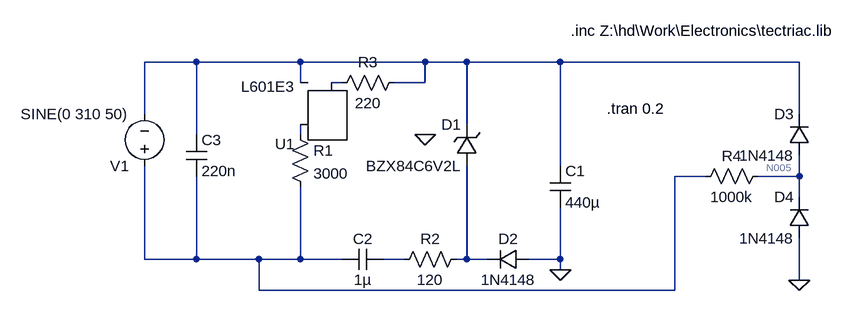
[diagram p0: schematic triac_experiments.asc]
triac_experiments.asc, the LTspice schematic file:
Version 4
SHEET 1 916 680
WIRE -128 32 -208 32
WIRE 32 32 -128 32
WIRE 224 32 32 32
WIRE 288 32 224 32
WIRE 432 32 288 32
WIRE 800 32 432 32
WIRE 32 64 32 32
WIRE 96 64 80 64
WIRE 224 64 224 32
WIRE 224 64 176 64
WIRE -208 112 -208 32
WIRE 800 112 800 32
WIRE 288 128 288 32
WIRE -128 144 -128 32
WIRE 32 144 32 128
WIRE 432 192 432 32
WIRE 656 208 608 208
WIRE 800 208 800 176
WIRE 800 208 736 208
WIRE 800 240 800 208
WIRE -208 336 -208 192
WIRE -128 336 -128 208
WIRE -128 336 -208 336
WIRE -32 336 -128 336
WIRE 32 336 32 224
WIRE 32 336 -32 336
WIRE 96 336 32 336
WIRE 192 336 160 336
WIRE 288 336 288 192
WIRE 288 336 272 336
WIRE 320 336 288 336
WIRE 432 336 432 256
WIRE 432 336 384 336
WIRE 432 352 432 336
WIRE 800 368 800 304
WIRE -32 384 -32 336
WIRE 608 384 608 208
WIRE 608 384 -32 384
FLAG 432 352 0
FLAG 224 144 0
FLAG 800 368 0
SYMBOL Misc\\TRIAC 64 128 R180
SYMATTR InstName U1
SYMATTR Value L601E3
SYMBOL voltage -208 208 R180
WINDOW 123 0 0 Left 2
WINDOW 39 0 0 Left 2
SYMATTR InstName V1
SYMATTR Value SINE(0 310 50)
SYMBOL res 16 128 R0
SYMATTR InstName R1
SYMATTR Value 3000
SYMBOL zener 304 192 R180
WINDOW 0 24 64 Left 2
WINDOW 3 24 0 Left 2
SYMATTR InstName D1
SYMATTR Value BZX84C6V2L
SYMBOL res 288 320 R90
WINDOW 0 0 56 VBottom 2
WINDOW 3 32 56 VTop 2
SYMATTR InstName R2
SYMATTR Value 120
SYMBOL diode 384 320 R90
WINDOW 0 0 32 VBottom 2
WINDOW 3 32 32 VTop 2
SYMATTR InstName D2
SYMATTR Value 1N4148
SYMBOL cap 416 192 R0
SYMATTR InstName C1
SYMATTR Value 440µ
SYMBOL res 192 48 R90
WINDOW 0 0 56 VBottom 2
WINDOW 3 32 56 VTop 2
SYMATTR InstName R3
SYMATTR Value 220
SYMBOL cap 160 320 R90
WINDOW 0 0 32 VBottom 2
WINDOW 3 32 32 VTop 2
SYMATTR InstName C2
SYMATTR Value 1µ
SYMBOL cap -144 144 R0
SYMATTR InstName C3
SYMATTR Value 220n
SYMBOL diode 816 176 R180
WINDOW 0 24 64 Left 2
WINDOW 3 24 0 Left 2
SYMATTR InstName D3
SYMATTR Value 1N4148
SYMBOL diode 816 304 R180
WINDOW 0 24 64 Left 2
WINDOW 3 24 0 Left 2
SYMATTR InstName D4
SYMATTR Value 1N4148
SYMBOL res 752 192 R90
WINDOW 0 0 56 VBottom 2
WINDOW 3 32 56 VTop 2
SYMATTR InstName R4
SYMATTR Value 1000k
TEXT 448 -16 Left 2 !.inc Z:\\hd\\Work\\Electronics\\tectriac.lib
TEXT 504 104 Left 2 !.tran 0.2

The netlist it stands for:
* triac_experiments.asc
XU1 N003 N002 N001 L601E3  ; pins MT2 G MT1
V1 N004 N001 SINE(0 310 50)
R1 N003 N004 3000
D1 N007 N001 BZX84C6V2L
R2 N007 N006 120
D2 0 N007 1N4148
C1 N001 0 440µ
R3 N001 N002 220
C2 N006 N004 1µ
C3 N001 N004 220n
D3 N005 N001 1N4148
D4 0 N005 1N4148
R4 N005 N004 1000k
.model D D
.lib standard.dio
.inc Z:\hd\Work\Electronics\tectriac.lib
.tran 0.2
.backanno
.end

* Results of the author's LTspice run, read from the files saved beside the schematic
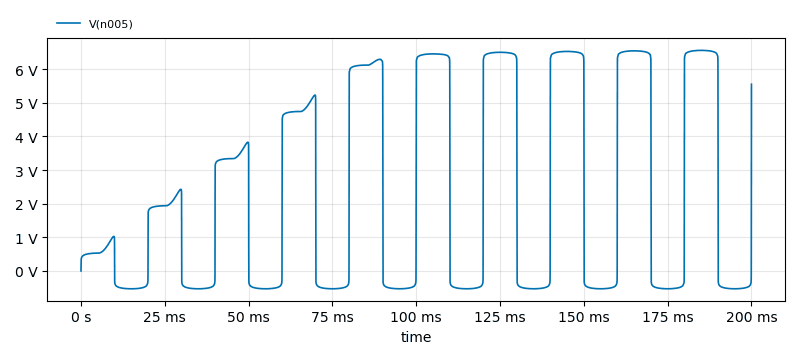
[diagram p1: Transient Analysis of triac_experiments.asc, plotted from the saved traces]
* Transient Analysis, 1 run:
*   V(n005): min -531 mV, max 6.561 V, average 2.241 V, rms 3.818 V, last 5.555 V